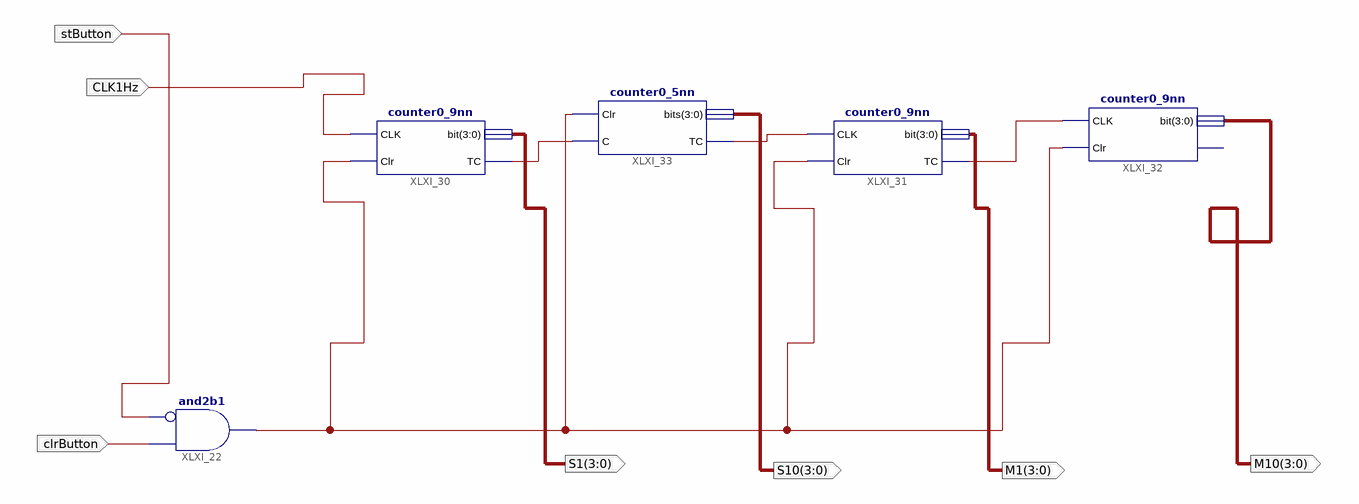
[diagram p0: schematic sheet 1]
// Xilinx ISE schematic Timernn.sch (spartan6) as structural Verilog: 5 symbols, 7 ports
module Timernn (
  input  CLK1Hz,
  input  clrButton,
  input  stButton,
  output [3:0] M10,
  output [3:0] M1,
  output [3:0] S10,
  output [3:0] S1
);

  wire XLXN_70, XLXN_72, XLXN_73, XLXN_74;

  and XLXI_22 (XLXN_73, ~stButton, clrButton);  // and2b1
  counter0_9nn XLXI_30 (.CLK(CLK1Hz), .Clr(XLXN_73), .\bit (S1), .TC(XLXN_72));
  counter0_9nn XLXI_31 (.CLK(XLXN_74), .Clr(XLXN_73), .\bit (M1), .TC(XLXN_70));
  counter0_9nn XLXI_32 (.CLK(XLXN_70), .Clr(XLXN_73), .\bit (M10));  // open: TC
  counter0_5nn XLXI_33 (.Clr(XLXN_73), .C(XLXN_72), .bits(S10), .TC(XLXN_74));
endmodule
